# EAGLE design InterfaceBoardRevB (EAGLE 7.2.0)
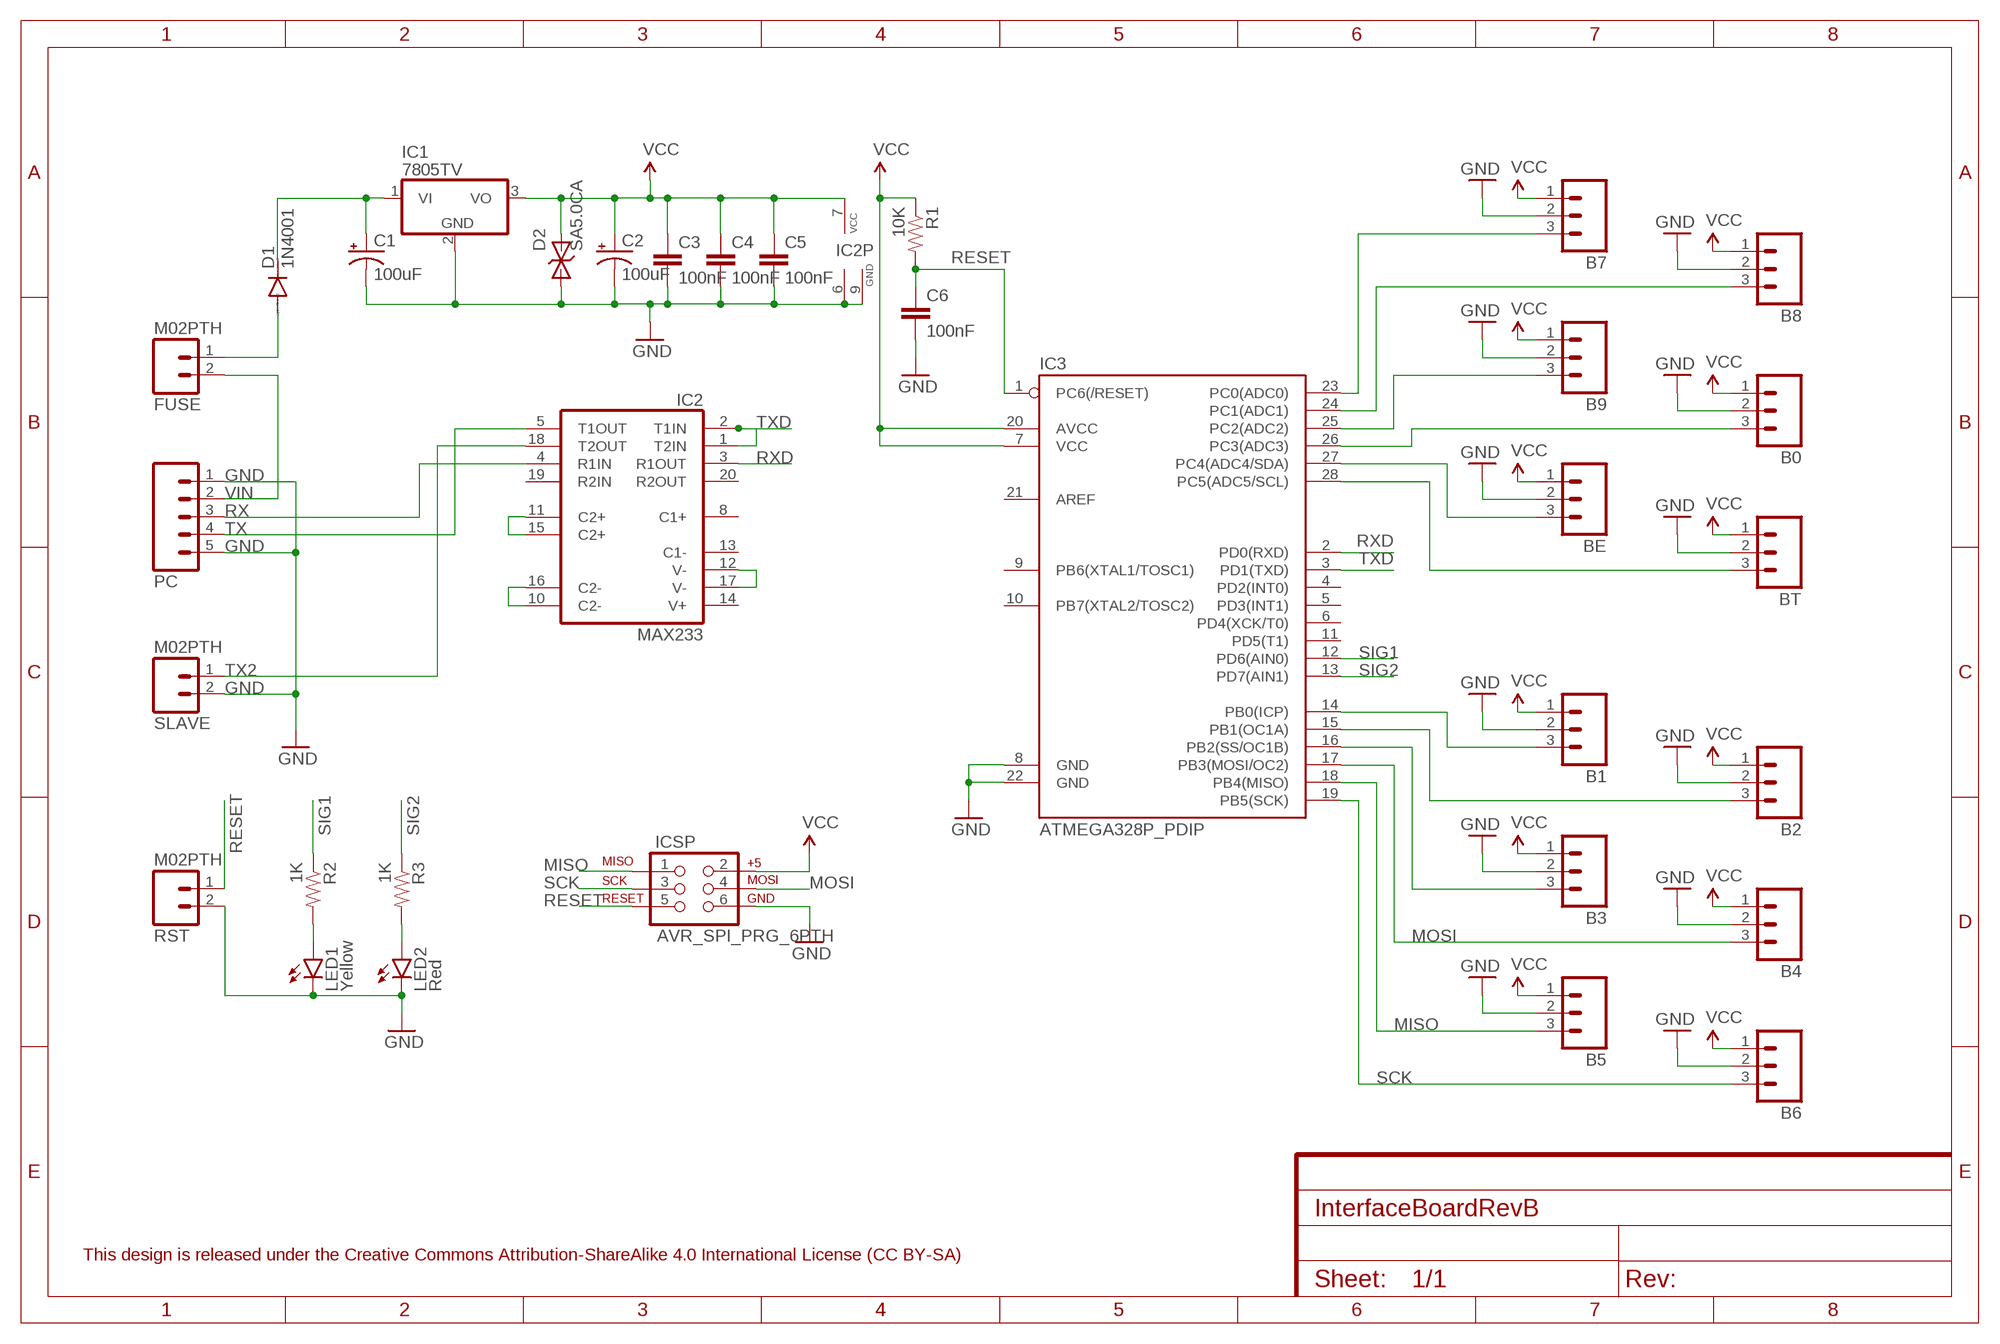
[diagram p0: schematic, sheet 1]
FRAME1 (FRAME-A4L): CNAME: Simulator Interface Board; CREVISION: B 02/2015; DESIGNER: A J Instone-Cowie

## Parts
B0  M03PTH  [1X03]
B1  M03PTH  [1X03]
B2  M03PTH  [1X03]
B3  M03PTH  [1X03]
B4  M03PTH  [1X03]
B5  M03PTH  [1X03]
B6  M03PTH  [1X03]
B7  M03PTH  [1X03]
B8  M03PTH  [1X03]
B9  M03PTH  [1X03]
BE  M03PTH  [1X03]
BT  M03PTH  [1X03]
C1  100uF  CAP_POLPTH1  [CPOL-RADIAL-100UF-25V]
C2  100uF  CAP_POLPTH1  [CPOL-RADIAL-100UF-25V]
C3  100nF  CAPPTH  [CAP-PTH-SMALL]
C4  100nF  CAPPTH  [CAP-PTH-SMALL]
C5  100nF  CAPPTH  [CAP-PTH-SMALL]
C6  100nF  CAPPTH  [CAP-PTH-SMALL]
D1  1N4001  [DO41_DIODE]
D2  SA5.0CA  [DO41_TVS]
FUSE  M02PTH  [1X02]
IC1  7805TV  [TO220V]
IC2  MAX233  [DIL20]
IC3  ATMEGA328P_PDIP  [DIL28-3]
ICSP  AVR_SPI_PRG_6PTH  [2X3]
LED1  Yellow  LED-LH3MM  [LED3MM_LARGEHOLES]
LED2  Red  LED-LH3MM  [LED3MM_LARGEHOLES]
PC  M05PTH  [1X05]
R1  10K  RESISTORPTH-1/4W  [AXIAL-0.4]
R2  1K  RESISTORPTH-1/4W  [AXIAL-0.4]
R3  1K  RESISTORPTH-1/4W  [AXIAL-0.4]
RST  M02PTH  [1X02]
SLAVE  M02PTH  [1X02]

## Nets
GND: B0.2 B1.2 B2.2 B3.2 B4.2 B5.2 B6.2 B7.2 B8.2 B9.2 BE.2 BT.2 C1.2(-) C2.2(-) C3.2 C4.2 C5.2 C6.2 D2.A IC1.2(GND) IC2.6(GND) IC2.9(GND) IC3.8(GND) IC3.22(GND) ICSP.6 LED1.K(C) LED2.K(C) PC.1 PC.5 RST.2 SLAVE.2
MISO: B5.3 IC3.18(PB4(MISO)) ICSP.1
MOSI: B4.3 IC3.17(PB3(MOSI/OC2)) ICSP.4
N$1: B7.3 IC3.23(PC0(ADC0))
N$2: B8.3 IC3.24(PC1(ADC1))
N$3: B9.3 IC3.25(PC2(ADC2))
N$4: B0.3 IC3.26(PC3(ADC3))
N$5: BT.3 IC3.28(PC5(ADC5/SCL))
N$6: BE.3 IC3.27(PC4(ADC4/SDA))
N$8: LED1.A R2.P$2
N$9: IC2.10(C2-) IC2.16(C2-)
N$10: B3.3 IC3.16(PB2(SS/OC1B))
N$11: B2.3 IC3.15(PB1(OC1A))
N$12: B1.3 IC3.14(PB0(ICP))
N$13: IC2.11(C2+) IC2.15(C2+)
N$14: IC2.12(V-) IC2.17(V-)
N$15: D1.A FUSE.1
N$16: LED2.A R3.P$2
N$26: C1.1(+) D1.C IC1.1(VI)
RESET: C6.1 IC3.1(PC6(/RESET)) ICSP.5 R1.P$2 RST.1
RX: IC2.4(R1IN) PC.3
RXD: IC2.3(R1OUT) IC3.2(PD0(RXD))
SCK: B6.3 IC3.19(PB5(SCK)) ICSP.3
SIG1: IC3.12(PD6(AIN0)) R2.P$1
SIG2: IC3.13(PD7(AIN1)) R3.P$1
TX: IC2.5(T1OUT) PC.4
TX2: IC2.18(T2OUT) SLAVE.1
TXD: IC2.1(T2IN) IC2.2(T1IN) IC3.3(PD1(TXD))
VCC: B0.1 B1.1 B2.1 B3.1 B4.1 B5.1 B6.1 B7.1 B8.1 B9.1 BE.1 BT.1 C2.1(+) C3.1 C4.1 C5.1 D2.C IC1.3(VO) IC2.7(VCC) IC3.7(VCC) IC3.20(AVCC) ICSP.2 R1.P$1
VIN: FUSE.2 PC.2
Unconnected: IC2.8(C1+) IC2.13(C1-) IC2.14(V+) IC2.19(R2IN) IC2.20(R2OUT) IC3.4(PD2(INT0)) IC3.5(PD3(INT1)) IC3.6(PD4(XCK/T0)) IC3.9(PB6(XTAL1/TOSC1)) IC3.10(PB7(XTAL2/TOSC2)) IC3.11(PD5(T1)) IC3.21(AREF)

## Notes on the sheet
- This design is released under the Creative Commons Attribution-ShareAlike 4.0 International License (CC BY-SA)

## Library data of the parts
B0 B1-B9 BE BT = SparkFun-Connectors:M03: Header 3 Standard 3-pin 0.1" header. Use with straight break away headers (SKU : PRT-00116), right angle break away headers (PRT-00553), swiss pins (PRT-00743), machine pins (PRT-00117), and female headers (PRT-00115). Molex polarized connector foot print use with SKU : PRT-08232 with associated crimp pins and housings.
C1 C2 = SparkFun-Passives:CAP_POL: Capacitor Polarized These are standard SMD and PTH capacitors. Normally 10uF, 47uF, and 100uF in electrolytic and tantalum varieties. Always verify the external diameter of the through hole cap, it varies with capacity, voltage, and manufacturer. The EIA devices should be standard.
C3-C6 = SparkFun-Capacitors:CAP: Capacitor Standard 0603 ceramic capacitor, and 0.1" leaded capacitor.
D1 = AIC_Custom:1N4001: DIODE general purpose rectifier, 1 A
D2 = AIC_Custom:SA5.0CA: SA5.0CA TVS Bi-Directional Transient Voltage Suppressor. 5V, DO41 package
FUSE RST SLAVE = SparkFun-Connectors:M02: Standard 2-pin 0.1" header. Use with - straight break away headers ( PRT-00116) - right angle break away headers (PRT-00553) - swiss pins (PRT-00743) - machine pins (PRT-00117) - female headers (PRT-00115) Molex polarized connector foot print use with: PRT-08233 with associated crimp pins and housings. 2.54_SCREWTERM for use with PRT-10571. 3.5mm Screw Terminal footprints for PRT-08084 5mm Screw Terminal footprints for use with PRT-08432
IC1 = linear:78*: Positive VOLTAGE REGULATOR Source: http://cache.national.com/ds/LM/LM78L05.pdf http://www.fairchildsemi.com/ds/LM/LM7805.pdf
IC2 = maxim:MAX233: RS232 TRANSCEIVER; MPN: MAX233ACPP+G36; OC_FARNELL: 1593332; OC_NEWARK: 89K3459
IC3 = SparkFun-DigitalIC:ATMEGA328P_PDIP: uC used in the Arduino 32kb flash, 1k EEPROM, 2k SRAM This is the through-hole version of this chip.
ICSP = SparkFun-Connectors:AVR_SPI_PRG_6: AVR ISP 6 Pin This is the reduced ISP connector for AVR programming. Common on Arduino. This footprint will take up less PCB space and can be used with a 10-pin to 6-pin adapter such as SKU: BOB-08508 **Special note about "TEST_POINT" package. The stop mask is on the top side, so if you want your programming test points to be on the bottom of your board, make sure to place this package on the bottom side of the board. This also ensure that the orientation to program from the bottom side will be correct.
LED1 LED2 = AIC_Custom:LED-LH: LEDs Standard schematic elements and footprints for 5mm, 3mm, 1206, and 0603 sized LEDs. 5mm - Spark Fun Electronics SKU : COM-00529 (and others). Custom variant with larger (0.04") holes suitable for header pins as an alternative.
PC = SparkFun-Connectors:M05: Header 5 Standard 5-pin 0.1" header. Use with straight break away headers (SKU : PRT-00116), right angle break away headers (PRT-00553), swiss pins (PRT-00743), machine pins (PRT-00117), and female headers (PRT-00115). Molex polarized connector foot print use with SKU : PRT-08230 with associated crimp pins and housings.
R1-R3 = SparkFun-Passives:RESISTOR: Resistor Basic schematic elements and footprints for 0603, 1206, and PTH resistors.

## Board
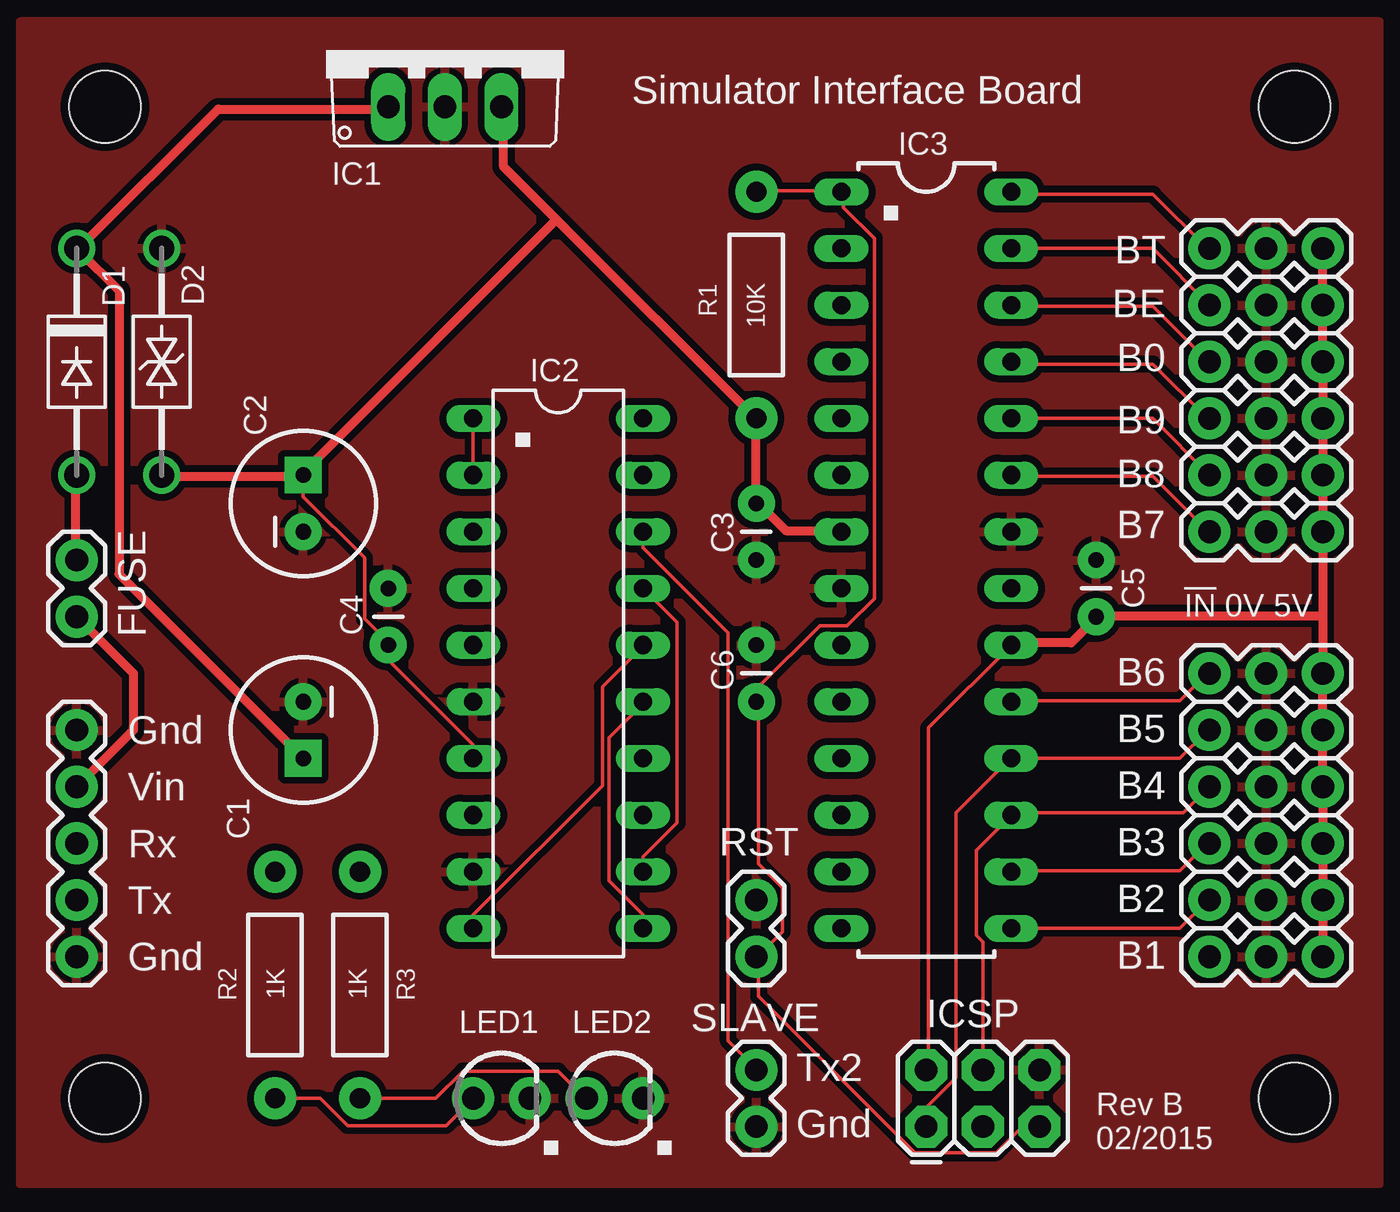
[diagram p1: board, top side]
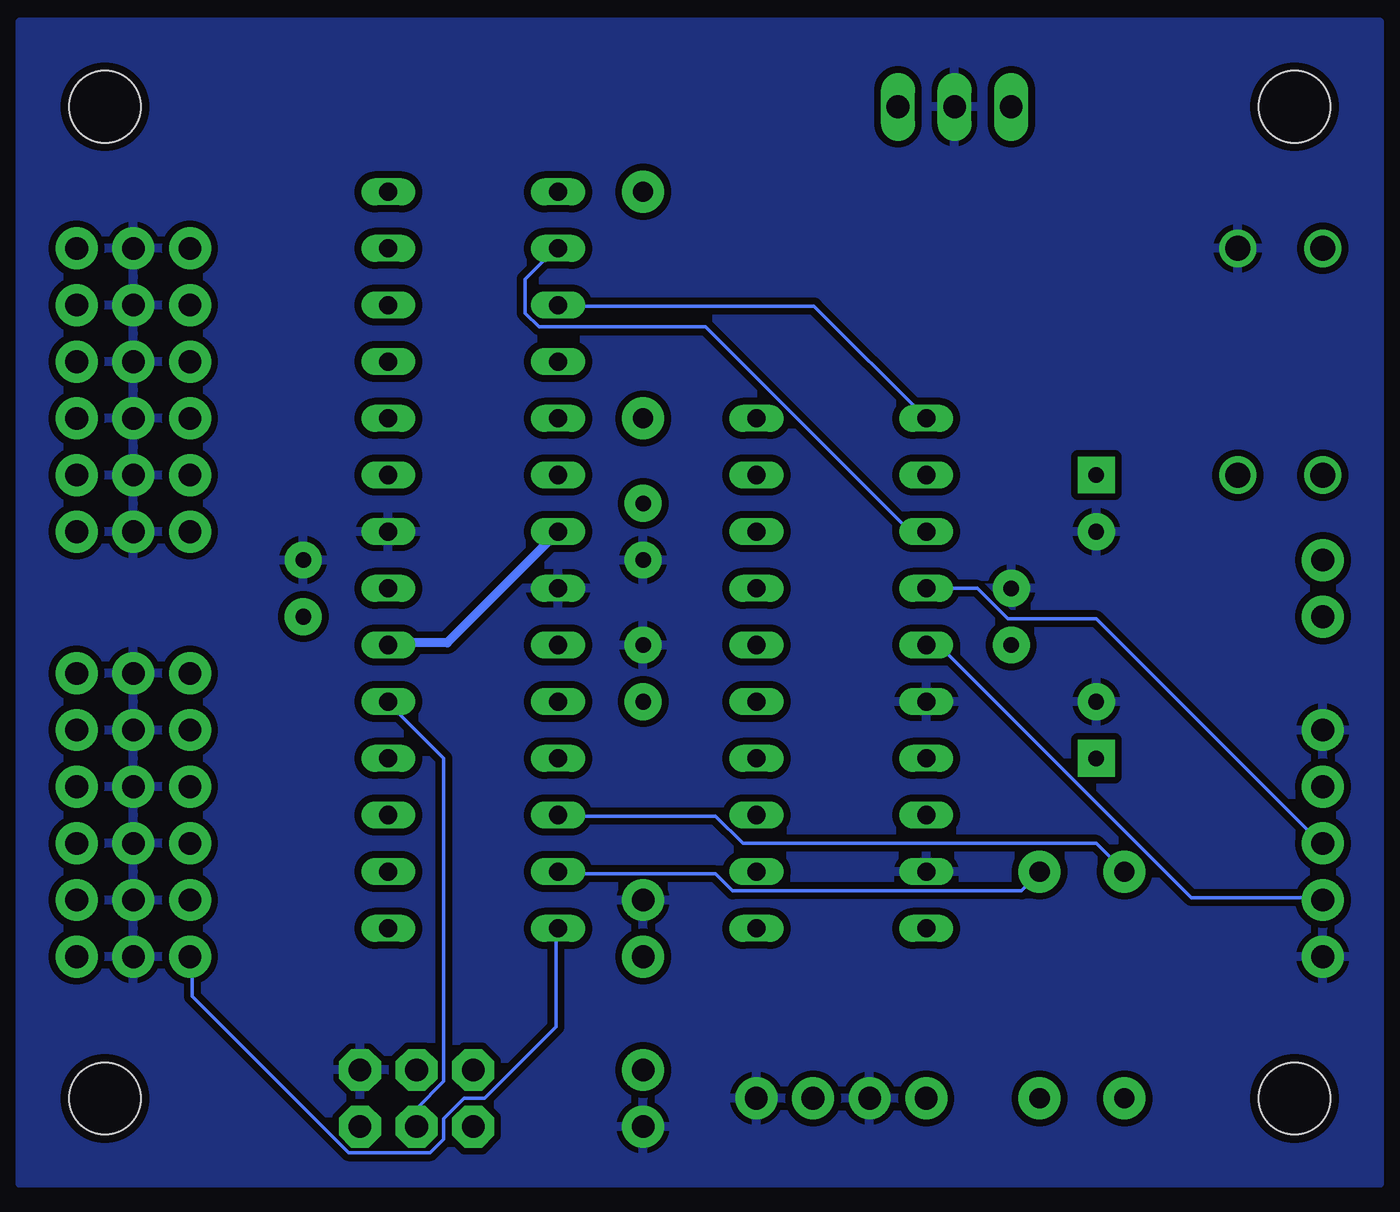
[diagram p2: board, bottom side, seen from below]

No outline drawn. Coordinates in mm, seen from the top.
Copper layers (1*16): Top 0.0356mm / dielectric 1.5011mm / Bottom 0.0356mm
Design rules "LaenPCBOrder(OSHPARK)": minimum track width 6mil, minimum drill 13mil, track to track 6mil, track to pad 6mil, pad to pad 6mil, via to via 6mil, smd to smd 6mil, copper to edge 15mil, drill to drill 6mil, minimum pad ring 7mil, minimum via ring 7mil, stop-mask expansion 3mil, vias tented up to drill 0mil, thermal gap 10mil
Holes 3.2 mm at 74.93,30.48 74.93,74.93 21.59,30.48 21.59,74.93

### Footprints (pad centres in the part's own frame; a part is rotated, then mirrored left to right if it is on the bottom)
1X03 = drill 1.016 pad 1.88: 1 0,0; 2 2.54,0; 3 5.08,0
CPOL-RADIAL-100UF-25V = drill 0.7 pad 1.651 square: 1 1.27,0 | drill 0.7 pad 1.651: 2 -1.27,0
CAP-PTH-SMALL = drill 0.7 pad 1.651: 1 0,0; 2 2.54,0
DO41_DIODE = drill 1.118: A 5.08,0; C -5.08,0
DO41_TVS = drill 1.118: A 5.08,0; C -5.08,0
1X02 = drill 1.016 pad 1.88: 1 0,0; 2 2.54,0
TO220V = drill 1.016 long: 1 -2.54,-2.54; 2 0,-2.54; 3 2.54,-2.54
DIL20 = drill 0.813 long: 1 -11.43,-3.81; 2 -8.89,-3.81; 3 -6.35,-3.81; 4 -3.81,-3.81; 5 -1.27,-3.81; 6 1.27,-3.81; 7 3.81,-3.81; 8 6.35,-3.81; 9 8.89,-3.81; 10 11.43,-3.81; 11 11.43,3.81; 12 8.89,3.81; 13 6.35,3.81; 14 3.81,3.81; 15 1.27,3.81; 16 -1.27,3.81; 17 -3.81,3.81; 18 -6.35,3.81; 19 -8.89,3.81; 20 -11.43,3.81
DIL28-3 = drill 0.813 long: 1 -16.51,-3.81; 2 -13.97,-3.81; 3 -11.43,-3.81; 4 -8.89,-3.81; 5 -6.35,-3.81; 6 -3.81,-3.81; 7 -1.27,-3.81; 8 1.27,-3.81; 9 3.81,-3.81; 10 6.35,-3.81; 11 8.89,-3.81; 12 11.43,-3.81; 13 13.97,-3.81; 14 16.51,-3.81; 15 16.51,3.81; 16 13.97,3.81; 17 11.43,3.81; 18 8.89,3.81; 19 6.35,3.81; 20 3.81,3.81; 21 1.27,3.81; 22 -1.27,3.81; 23 -3.81,3.81; 24 -6.35,3.81; 25 -8.89,3.81; 26 -11.43,3.81; 27 -13.97,3.81; 28 -16.51,3.81
2X3 = drill 1.016 pad 1.88 octagon: 1 0,0; 2 0,2.54; 3 2.54,0; 4 2.54,2.54; 5 5.08,0; 6 5.08,2.54
LED3MM_LARGEHOLES = drill 1.016 pad 1.88: A -1.27,0; K 1.27,0
1X05 = drill 1.016 pad 1.88: 1 0,0; 2 2.54,0; 3 5.08,0; 4 7.62,0; 5 10.16,0
AXIAL-0.4 = drill 0.9 pad 1.88: P$1 -5.08,0; P$2 5.08,0

### Placement (x,y rotation side)
B0  76.2,63.5 180 top
B1  76.2,36.83 180 top
B2  76.2,39.37 180 top
B3  76.2,41.91 180 top
B4  76.2,44.45 180 top
B5  76.2,46.99 180 top
B6  76.2,49.53 180 top
B7  76.2,55.88 180 top
B8  76.2,58.42 180 top
B9  76.2,60.96 180 top
BE  76.2,66.04 180 top
BT  76.2,68.58 180 top
C1  30.48,46.99 270 top
C2  30.48,57.15 90 top
C3  50.8,57.15 270 top
C4  34.29,50.8 90 top
C5  66.04,52.07 90 top
C6  50.8,48.26 90 top
D1  20.32,63.5 270 top
D2  24.13,63.5 90 top
FUSE  20.32,54.61 270 top
IC1  36.83,77.47 0 top
IC2  41.91,49.53 270 top
IC3  58.42,54.61 270 top
ICSP  58.42,29.21 0 top
LED1  39.37,30.48 0 top
LED2  44.45,30.48 0 top
PC  20.32,46.99 270 top
R1  50.8,66.04 90 top
R2  29.21,35.56 270 top
R3  33.02,35.56 270 top
RST  50.8,36.83 90 top
SLAVE  50.8,31.75 270 top

### Tracks (layer width: path | path; a pad name or v marks a point on that pad's centre or on a via)
GND
  pour Bottom (isolate 0.305): 17.78,78.74 17.78,26.67 78.74,26.67 78.74,78.74
  pour Top (isolate 0.305): 17.78,78.74 17.78,26.67 78.74,26.67 78.74,78.74
MISO
  Top 0.152: B5.3 71.02,46.94 69.8,45.72 IC3.18 62.18,45.72 59.74,43.28 59.74,31.39 58.52,30.18 58.52,29.26 ICSP.1
MOSI
  Top 0.152: B4.3 69.95,43.28 62.33,43.28 IC3.17 60.66,41.6 60.66,37.8 60.96,37.49 ICSP.4
N$1
  Top 0.152: IC3.23 62.33,58.37 68.58,58.37 71.02,55.93 B7.3
N$2
  Top 0.152: IC3.24 68.58,60.96 B8.3
N$3
  Top 0.152: IC3.25 62.33,63.4 68.58,63.4 71.02,60.96 B9.3
N$4
  Top 0.152: IC3.26 62.33,65.99 68.58,65.99 71.02,63.55 B0.3
N$5
  Top 0.152: IC3.28 62.33,71.02 68.58,71.02 71.02,68.58 BT.3
N$6
  Top 0.152: IC3.27 68.58,68.58 BE.3
N$8
  Top 0.152: R2.P$2 31.24,30.48 32.46,29.26 36.88,29.26 LED1.A
N$9
  Top 0.152: IC2.10 38.1,38.71 43.89,44.5 43.89,48.92 45.72,50.75 IC2.16
N$10
  Top 0.152: IC3.16 62.33,40.69 69.8,40.69 71.02,41.91 B3.3
N$11
  Top 0.152: IC3.15 69.8,38.1 71.02,39.32 B2.3
N$12
  Bottom 0.152: IC3.14 54.71,38.1 54.71,33.68 57.91,30.48 58.83,30.48 59.74,29.57 59.74,28.65 60.35,28.04 64.01,28.04 71.02,35.05 71.02,36.73 B1.3
N$13
  Top 0.152: IC2.11 45.72,38.71 44.2,40.23 44.2,46.63 45.72,48.16 IC2.15
N$14
  Top 0.152: IC2.12 45.72,41.3 47.24,42.82 47.24,51.82 IC2.17
N$15
  Top 0.152: 20.27,58.37 D1.A | 20.27,54.71 FUSE.1
  Top 0.406: 20.27,54.71 20.27,58.37
N$16
  Top 0.152: R3.P$2 36.42,30.48 37.64,31.7 41.91,31.7 43.13,30.48 LED2.A
N$26
  Top 0.152: 34.29,74.83 IC1.1 | 20.42,68.58 D1.C
  Top 0.406: 34.29,74.83 26.67,74.83 20.42,68.58 20.42,68.48 22.23,66.67 22.23,53.98 C1.1
RESET
  Top 0.152: R1.P$2 50.9,71.17 54.56,71.17 IC3.1 54.71,71.02 54.71,70.41 56.08,69.04 56.08,52.88 54.86,51.66 53.65,51.66 50.9,48.92 50.9,48.31 C6.1 50.9,48.16 50.9,41 51.97,39.93 51.97,37.95 50.9,36.88 RST.1 50.9,36.73 50.9,35.05 57.91,28.04 61.57,28.04 62.64,29.11 63.4,29.11 ICSP.5
RX
  Bottom 0.152: IC2.4 35.81,53.34 34.44,51.97 30.48,51.97 20.42,41.91 PC.3
RXD
  Bottom 0.152: IC2.3 38.1,55.93 38.86,55.93 48.01,65.08 55.47,65.08 56.08,65.68 56.08,67.21 54.71,68.58 IC3.2
SCK
  Top 0.152: IC3.19 62.33,48.31 69.8,48.31 71.02,49.53 B6.3
  Bottom 0.152: ICSP.3 60.96,30.02 59.74,31.24 59.74,45.72 62.18,48.16 IC3.19
SIG1
  Bottom 0.152: R2.P$1 30.48,41.91 46.33,41.91 47.55,43.13 54.56,43.13 IC3.12
SIG2
  Bottom 0.152: IC3.13 54.56,40.54 47.55,40.54 46.79,39.78 33.83,39.78 33.07,40.54 R3.P$1
TX
  Bottom 0.152: IC2.5 38.1,50.75 37.49,50.75 26.21,39.47 20.42,39.47 PC.4
TX2
  Top 0.152: IC2.18 45.72,55.17 49.53,51.36 49.53,33.07 50.75,31.85 SLAVE.1
TXD
  Top 0.152: IC2.1 IC2.2
  Bottom 0.152: IC2.1 43.13,65.99 54.56,65.99 IC3.3
VCC
  Top 0.152: 62.33,50.9 IC3.20 58.52,47.09 58.52,31.85 ICSP.2 | 65.99,51.97 C5.1 66.14,52.12 | 24.23,58.37 D2.C | IC2.7 38.1,46.33 34.29,50.14 C4.1 34.29,50.9 33.22,51.97 33.22,54.71 30.48,57.45 30.48,58.37 C2.1 30.48,58.52 | 54.56,55.93 IC3.7 | 50.9,57.15 C3.1 50.75,57.15 | 39.47,74.83 IC1.3 | 50.75,60.96 R1.P$1 | 41.76,69.95 41.76,69.8
  Top 0.406: B1.1 B2.1 B3.1 B4.1 B5.1 B6.1 76.2,52.12 | BT.1 BE.1 B0.1 B9.1 B8.1 B7.1 76.2,52.12 | 62.33,50.9 64.92,50.9 65.99,51.97 | 24.23,58.37 30.48,58.37 | 54.56,55.93 52.12,55.93 50.9,57.15 | 39.47,74.83 39.47,72.24 41.76,69.95 50.75,60.96 50.75,57.15 | 41.76,69.8 30.48,58.52 | 66.14,52.12 76.2,52.12
  Bottom 0.152: 62.18,50.9 IC3.20
  Bottom 0.406: 62.18,50.9 59.59,50.9 IC3.7
VIN
  Top 0.406: FUSE.2 22.86,49.53 22.86,46.99 PC.2

### Text on the board
tPlace: Simulator Interface Board | !IN! 0V 5V | Gnd / Vin / Rx / Tx / Gnd | Tx2 / Gnd | Rev B / 02/2015